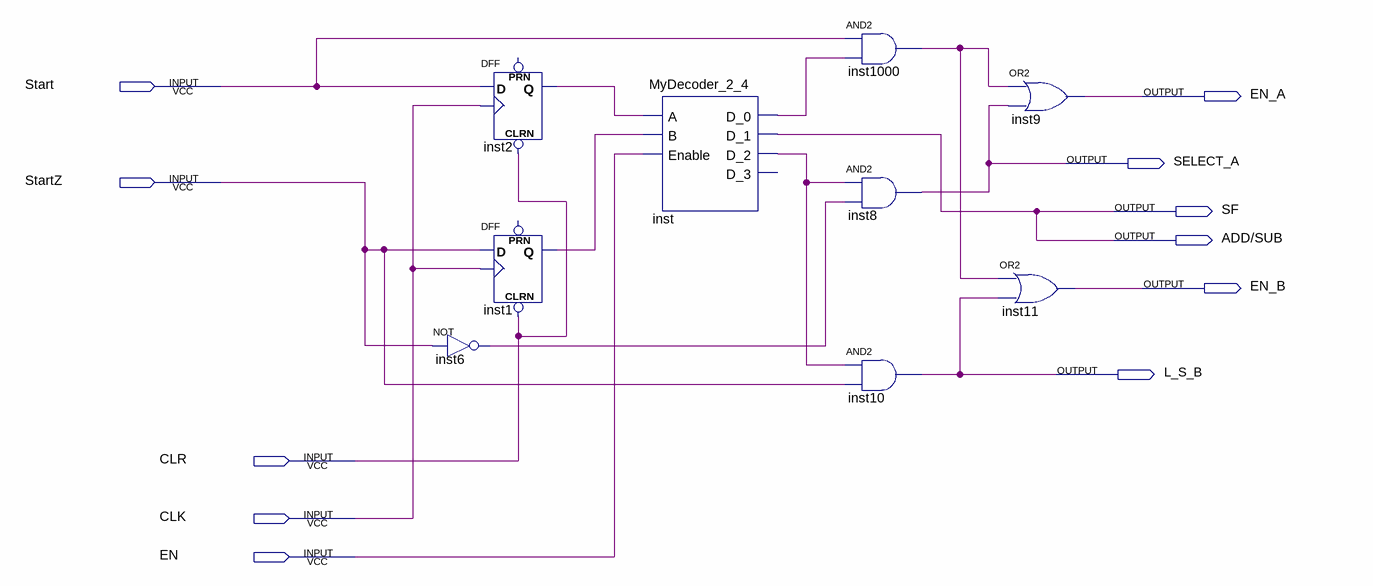
[diagram p0: schematic sheet]
// Quartus schematic controller_only.bdf as structural Verilog: 9 symbols, 11 pins
module controller_only (
  input  Start,
  input  StartZ,
  input  CLR,
  input  CLK,
  input  EN,
  output EN_A,
  output SELECT_A,
  output SF,
  output \ADD/SUB ,
  output EN_B,
  output L_S_B
);

  wire inst1_q, inst2_q, inst6_out, inst1000_out, inst_d_0, inst_d_2;

  not inst6 (inst6_out, StartZ);
  DFF inst2 (.CLRN(CLR), .CLK(CLK), .D(Start), .Q(inst2_q));  // open: PRN
  DFF inst1 (.CLRN(CLR), .CLK(CLK), .D(StartZ), .Q(inst1_q));  // open: PRN
  MyDecoder_2_4 inst (
    .A(inst2_q), .B(inst1_q), .Enable(EN), .D_0(inst_d_0), .D_1(\ADD/SUB ), .D_2(inst_d_2));  // open: D_3
  and inst1000 (inst1000_out, Start, inst_d_0);
  and inst8 (SELECT_A, inst_d_2, inst6_out);
  and inst10 (L_S_B, inst_d_2, StartZ);
  or inst9 (EN_A, inst1000_out, SELECT_A);
  or inst11 (EN_B, inst1000_out, L_S_B);

  assign SF = \ADD/SUB ;
endmodule
